# Altium schematic sheet TriMod Adapter 2.SchDoc
size 420 x 297 mm; ApprovedBy: .; CheckedBy: .; Author: DiWou; CompanyName: DL2DW; DrawnBy: DiWou; Engineer: DIWou; Organization: DL2DW; DocumentNumber: 1; Revision: -; SheetNumber: 1; SheetTotal: 1; DrawnDate: 18.12.2020; EngrDate: .; ChkdDate: .; Title1: TriMod Adapter 2.0; Title2: .; Title3: .; Desc1: Version 1.1; Desc2: .; ApprDate: .
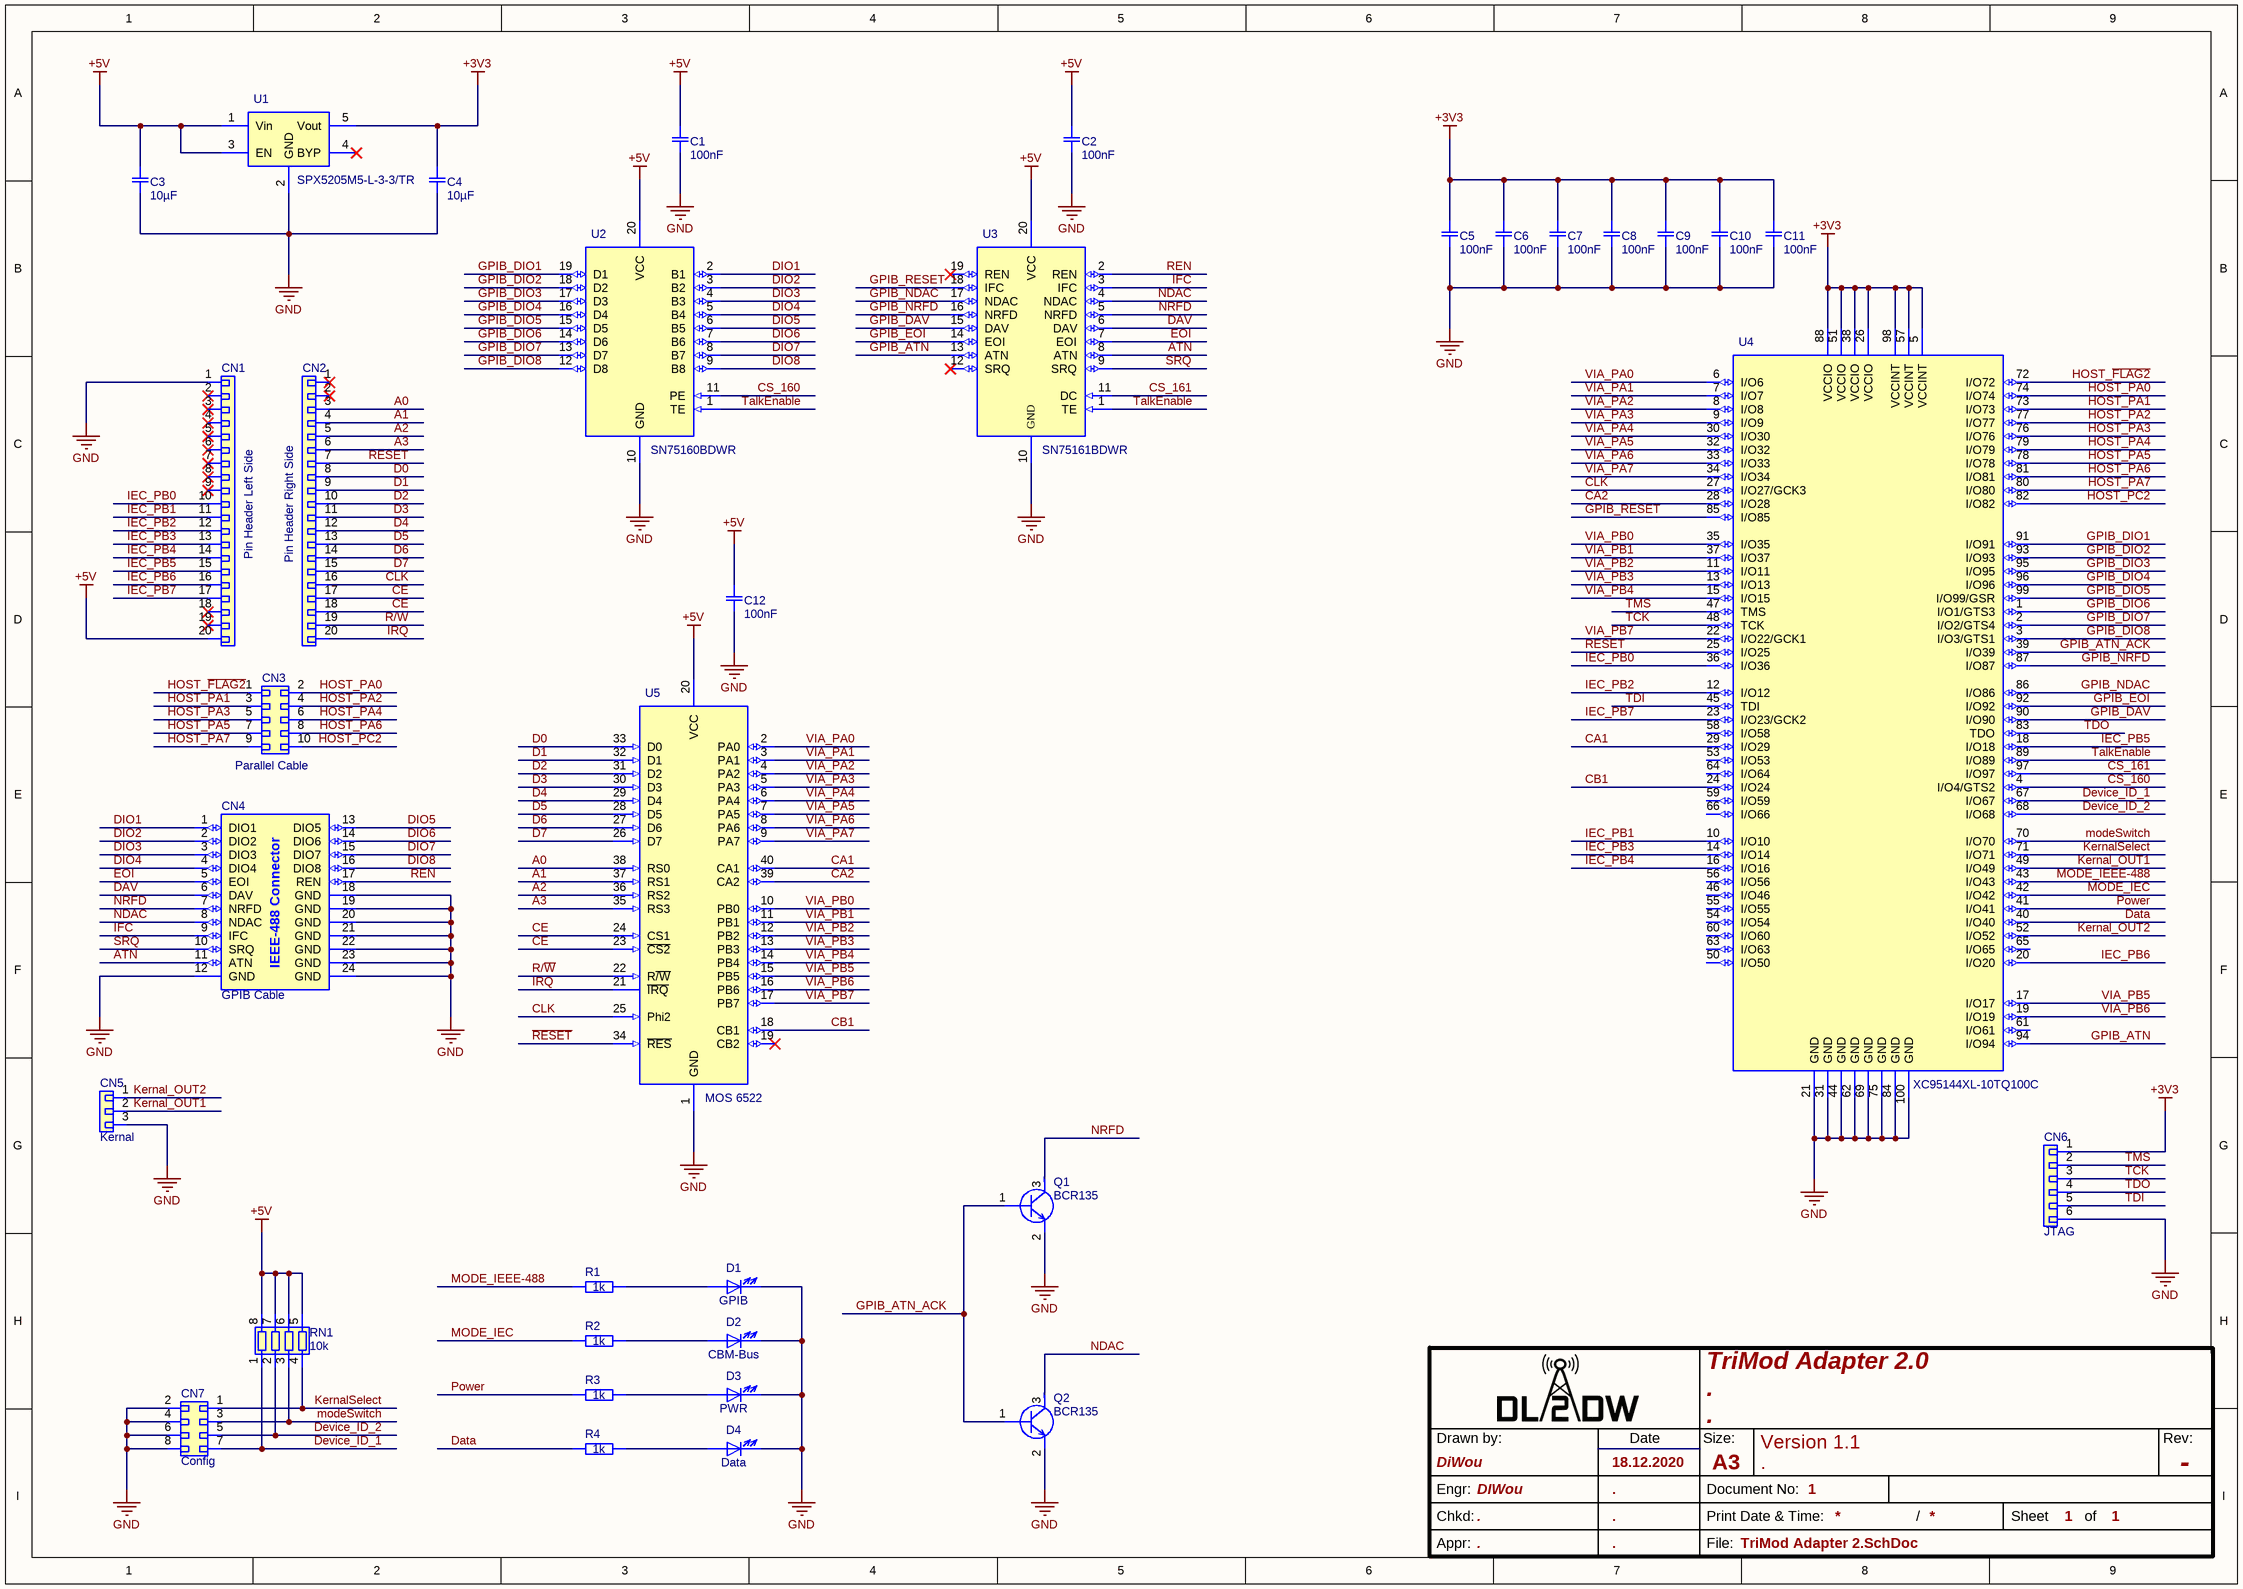
[diagram p0: TriMod Adapter 2.SchDoc]

## Parts
C1  100nF  [CAP 100nF SMD 0603 C0603C104J3RACTU]
C2  100nF  [CAP 100nF SMD 0603 C0603C104J3RACTU]
C3  10µF  [Kemet C0805CxxxK8RACTU Series H=1.4mm]
C4  10µF  [Kemet C0805CxxxK8RACTU Series H=1.4mm]
C5  100nF  [CAP 100nF SMD 0603 C0603C104J3RACTU]
C6  100nF  [CAP 100nF SMD 0603 C0603C104J3RACTU]
C7  100nF  [CAP 100nF SMD 0603 C0603C104J3RACTU]
C8  100nF  [CAP 100nF SMD 0603 C0603C104J3RACTU]
C9  100nF  [CAP 100nF SMD 0603 C0603C104J3RACTU]
C10  100nF  [CAP 100nF SMD 0603 C0603C104J3RACTU]
C11  100nF  [CAP 100nF SMD 0603 C0603C104J3RACTU]
C12  100nF  [CAP 100nF SMD 0603 C0603C104J3RACTU]
CN1  Pin Header Left Side  [Pin Header 01x20 2.54mm precision Horizontal Male]
CN2  Pin Header Right Side  [Pin Header 01x20 2.54mm precision Horizontal Male]
CN3  Parallel Cable  [MPE 369-1-010 Buchsenleisten MicroMatch 1,27 mm,2X05,gerade]
CN4  GPIB Cable  [IEEE-488 Micro Match Connector]
CN5  Kernal  [Pin Header 01x03 2.54mm Horizontal Male]
CN6  JTAG  [Pin Header 01x06 2.54mm Horizontal Male]
CN7  Config  [Pin Header 02x04 2.54mm Horizontal Male]
D1  GPIB  [LED Blue SMD 0603]
D2  CBM-Bus  [LED Green SMD 0603]
D3  PWR  [LED Red SMD 0603]
D4  Data  [LED Yellow SMD 0603]
Q1  BCR135  [BCR135 SOT23]
Q2  BCR135  [BCR135 SOT23]
R1  1k  [1k Ohm R 0603 SMD]
R2  1k  [1k Ohm R 0603 SMD]
R3  1k  [1k Ohm R 0603 SMD]
R4  1k  [1k Ohm R 0603 SMD]
RN1  10k  [RES ARRAY 4 RES 10K OHM 0804]
U1  SPX5205M5-L-3-3/TR  [SOT-23-5]
U2  SN75160BDWR  [SN75160BDWR SOIC-20 W7.5mm P1,27mm]
U3  SN75161BDWR  [SN75161BDWR SOIC-20 W7.5mm P1,27mm]
U4  XC95144XL-10TQ100C  [TQFP-100 P0.5mm XC95144XL-7TQ100C]
U5  MOS 6522  [MOS 6522 with Socket]

## Nets
+3V3: C4.2 C5.2 C6.2 C7.2 C8.2 C9.2 C10.2 C11.2 CN6.1 U1.5(Vout) U4.5(VCCINT) U4.26(VCCIO) U4.38(VCCIO) U4.51(VCCIO) U4.57(VCCINT) U4.88(VCCIO) U4.98(VCCINT)
+5V: C1.2 C2.2 C3.2 C12.2 CN1.20 RN1.5 RN1.6 RN1.7 RN1.8 U1.1(Vin) U1.3(EN) U2.20(VCC) U3.20(VCC) U5.20(VCC)
GND: C1.1 C2.1 C3.1 C4.1 C5.1 C6.1 C7.1 C8.1 C9.1 C10.1 C11.1 C12.1 CN1.1 CN4.12(GND) CN4.18(GND) CN4.19(GND) CN4.20(GND) CN4.21(GND) CN4.22(GND) CN4.23(GND) CN4.24(GND) CN5.3 CN6.6 CN7.2 CN7.4 CN7.6 CN7.8 D1.1 D2.1 D3.1 D4.1 Q1.2 Q2.2 U1.2(GND) U2.10(GND) U3.10(GND) U4.21(GND) U4.31(GND) U4.44(GND) U4.62(GND) U4.69(GND) U4.75(GND) U4.84(GND) U4.100(GND) U5.1(GND)
A0: CN2.3 U5.38(RS0)
A1: CN2.4 U5.37(RS1)
A2: CN2.5 U5.36(RS2)
A3: CN2.6 U5.35(RS3)
ATN: CN4.11(ATN) U3.8(ATN)
~{CE}: CN2.18 U5.23(~{CS2})
CA1: U4.29(I/O29) U5.40(CA1)
CA2: U4.28(I/O28) U5.39(CA2)
CB1: U4.24(I/O24) U5.18(CB1)
CE: CN2.17 U5.24(CS1)
CLK: CN2.16 U4.27(I/O27/GCK3) U5.25(Phi2)
CS_160: U2.11(PE) U4.4(I/O4/GTS2)
CS_161: U3.11(DC) U4.97(I/O97)
D0: CN2.8 U5.33(D0)
D1: CN2.9 U5.32(D1)
D2: CN2.10 U5.31(D2)
D3: CN2.11 U5.30(D3)
D4: CN2.12 U5.29(D4)
D5: CN2.13 U5.28(D5)
D6: CN2.14 U5.27(D6)
D7: CN2.15 U5.26(D7)
Data: R4.1 U4.40(I/O40)
DAV: CN4.6(DAV) U3.6(DAV)
Device_ID_1: CN7.7 RN1.1 U4.67(I/O67)
Device_ID_2: CN7.5 RN1.2 U4.68(I/O68)
DIO1: CN4.1(DIO1) U2.2(B1)
DIO2: CN4.2(DIO2) U2.3(B2)
DIO3: CN4.3(DIO3) U2.4(B3)
DIO4: CN4.4(DIO4) U2.5(B4)
DIO5: CN4.13(DIO5) U2.6(B5)
DIO6: CN4.14(DIO6) U2.7(B6)
DIO7: CN4.15(DIO7) U2.8(B7)
DIO8: CN4.16(DIO8) U2.9(B8)
EOI: CN4.5(EOI) U3.7(EOI)
GPIB_ATN: U3.13(ATN) U4.94(I/O94)
GPIB_ATN_ACK: Q1.1 Q2.1 U4.39(I/O39)
GPIB_DAV: U3.15(DAV) U4.90(I/O90)
GPIB_DIO1: U2.19(D1) U4.91(I/O91)
GPIB_DIO2: U2.18(D2) U4.93(I/O93)
GPIB_DIO3: U2.17(D3) U4.95(I/O95)
GPIB_DIO4: U2.16(D4) U4.96(I/O96)
GPIB_DIO5: U2.15(D5) U4.99(I/O99/GSR)
GPIB_DIO6: U2.14(D6) U4.1(I/O1/GTS3)
GPIB_DIO7: U2.13(D7) U4.2(I/O2/GTS4)
GPIB_DIO8: U2.12(D8) U4.3(I/O3/GTS1)
GPIB_EOI: U3.14(EOI) U4.92(I/O92)
GPIB_NDAC: U3.17(NDAC) U4.86(I/O86)
GPIB_NRFD: U3.16(NRFD) U4.87(I/O87)
GPIB_RESET: U3.18(IFC) U4.85(I/O85)
HOST_~{FLAG2}: CN3.1 U4.72(I/O72)
HOST_~{PC2}: CN3.10 U4.82(I/O82)
HOST_PA0: CN3.2 U4.74(I/O74)
HOST_PA1: CN3.3 U4.73(I/O73)
HOST_PA2: CN3.4 U4.77(I/O77)
HOST_PA3: CN3.5 U4.76(I/O76)
HOST_PA4: CN3.6 U4.79(I/O79)
HOST_PA5: CN3.7 U4.78(I/O78)
HOST_PA6: CN3.8 U4.81(I/O81)
HOST_PA7: CN3.9 U4.80(I/O80)
~{IRQ}: CN2.20 U5.21(~{IRQ})
IEC_PB0: CN1.10 U4.36(I/O36)
IEC_PB1: CN1.11 U4.10(I/O10)
IEC_PB2: CN1.12 U4.12(I/O12)
IEC_PB3: CN1.13 U4.14(I/O14)
IEC_PB4: CN1.14 U4.16(I/O16)
IEC_PB5: CN1.15 U4.18(I/O18)
IEC_PB6: CN1.16 U4.20(I/O20)
IEC_PB7: CN1.17 U4.23(I/O23/GCK2)
IFC: CN4.9(IFC) U3.3(IFC)
Kernal_OUT1: CN5.2 U4.49(I/O49)
Kernal_OUT2: CN5.1 U4.52(I/O52)
KernalSelect: CN7.1 RN1.4 U4.71(I/O71)
MODE_IEC: R2.1 U4.42(I/O42)
MODE_IEEE-488: R1.1 U4.43(I/O43)
modeSwitch: CN7.3 RN1.3 U4.70(I/O70)
NDAC: CN4.8(NDAC) Q2.3 U3.4(NDAC)
NRFD: CN4.7(NRFD) Q1.3 U3.5(NRFD)
Power: R3.1 U4.41(I/O41)
R/~{W}: CN2.19 U5.22(R~{/W})
~{RESET}: CN2.7 U4.25(I/O25) U5.34(~{RES})
REN: CN4.17(REN) U3.2(REN)
SRQ: CN4.10(SRQ) U3.9(SRQ)
TalkEnable: U2.1(TE) U3.1(TE) U4.89(I/O89)
TCK: CN6.3 U4.48(TCK)
TDI: CN6.5 U4.45(TDI)
TDO: CN6.4 U4.83(TDO)
TMS: CN6.2 U4.47(TMS)
VIA_PA0: U4.6(I/O6) U5.2(PA0)
VIA_PA1: U4.7(I/O7) U5.3(PA1)
VIA_PA2: U4.8(I/O8) U5.4(PA2)
VIA_PA3: U4.9(I/O9) U5.5(PA3)
VIA_PA4: U4.30(I/O30) U5.6(PA4)
VIA_PA5: U4.32(I/O32) U5.7(PA5)
VIA_PA6: U4.33(I/O33) U5.8(PA6)
VIA_PA7: U4.34(I/O34) U5.9(PA7)
VIA_PB0: U4.35(I/O35) U5.10(PB0)
VIA_PB1: U4.37(I/O37) U5.11(PB1)
VIA_PB2: U4.11(I/O11) U5.12(PB2)
VIA_PB3: U4.13(I/O13) U5.13(PB3)
VIA_PB4: U4.15(I/O15) U5.14(PB4)
VIA_PB5: U4.17(I/O17) U5.15(PB5)
VIA_PB6: U4.19(I/O19) U5.16(PB6)
VIA_PB7: U4.22(I/O22/GCK1) U5.17(PB7)
NetD1_2: D1.2 R1.2
NetD2_2: D2.2 R2.2
NetD3_2: D3.2 R3.2
NetD4_2: D4.2 R4.2

Not connected (* = marked no-connect by the designer): CN1 2* 3* 4* 5* 6* 7* 8* 9* 18* 19*; CN2 1* 2*; U1 4(BYP)*; U3 12(SRQ)* 19(REN)*; U4 46(I/O46) 50(I/O50) 53(I/O53) 54(I/O54) 55(I/O55) 56(I/O56) 58(I/O58) 59(I/O59) 60(I/O60) 61(I/O61) 63(I/O63) 64(I/O64) 65(I/O65) 66(I/O66); U5 19(CB2)*

## Notes on the sheet
- Drawn by:
- Date
- Size:
- A3
- Rev:
- Engr:
- Chkd:
- Appr:
- File:
- Document No:
- Print Date & Time:
- /
- Sheet
- of

## Library data of the parts
C1 C2 C5-C12 = CMP-Capacitors-Ceramic_Capacitors-00012-1: KEMET         C0603C104J3RACTU             SMD Multilayer Ceramic Capacitor, 0603 [1608 Metric], 0.1 F, 25 V,  5%, X7R, C Series; Voltage Rating (DC): 25V; Height: 0.8mm; Dielectric: X7R; Case Code (Metric): 1608; Width: 0.031inch; Depth: 0.8mm; Min Operating Temperature: -55°C; Number of Pins: 2; Mount: Surface Mount,PCB; REACH SVHC: No SVHC; Packaging: Tape and Reel; Case Code (Imperial): 0603; Contact Plating: Tin,Matte; Length: 1.6mm; Case/Package: 0603; Lead Pitch: 0.7mm; Package Quantity: 4000; Tolerance: 5%; Radiation Hardening: No; Dielectric Material: Ceramic; Voltage: 25V; Termination: SMD/SMT; Capacitance: 100nF; Voltage Rating: 25V; Thickness: 0.034inch; Max Operating Temperature: 125°C
C3 C4 = CMP-Capacitors-Ceramic_Capacitors-00016-2: KEMET - C0805C106K8RACTU - CAP, 10µF, 10V, 10%, X7R, 0805; Dissipation Factor: 7.5%; Capacitance: 10uF; Max Operating Temperature: 125°C; Packaging: Tape and Reel; Case Code (Imperial): 0805; Depth: 1.25mm; Dielectric Material: Ceramic; Voltage: 10V; Voltage Rating (DC): 10V; Mount: Surface Mount,PCB; Min Operating Temperature: -55°C; Case Code (Metric): 2012; Case/Package: 0805; Thickness: 0.055inch; Termination: SMD/SMT; Voltage Rating: 10V; Height: 1.25mm; Dielectric: X7R; Width: 1.2mm; Package Quantity: 1; Length: 2mm; REACH SVHC: No SVHC; Tolerance: 10%
CN1 CN2 = CMP-Connectors-Male_PIN_Headers-00031-2: Conn Header Vert 20POS 2MM; Connector Type: Male Pin; Number of Positions: 20; Pitch: 0.079inch; Contact Mating Length: 0.141inch; Package Quantity: 250; Mount: Through Hole; Color: Black; Packaging: Bulk; Contact Plating: Gold; Number of Rows: 1; Termination: Solder
CN3 = CMP-Connectors-IDC_Connectors-00031-3: Grid pitch: 1.27 mm BL2/15-0400GTT-010 RU MPE Garry Conten; Pitch: 1.27mm; Height: 3.95mm; Contact Material: Bronze,Tin; Length: 14.62mm; Insulation Material: Thermoplastic; Width: 5mm
CN4 = CMP-Commodore-00011-5: IEEE-488 IDC Connector Right Angle or Straight
CN5 = CMP-Connectors-Male_PIN_Headers-00002-3: CONN HEADER .100" SNGL STR 3POS; Pitch: 0.1inch; Number of Positions: 3; Connector Type: Male Pin; Mount: Through Hole; Color: Black; Contact Mating Length: 0.318inch; Package Quantity: 1; Termination: Solder; Number of Rows: 1; Contact Plating: Gold; Packaging: Bulk
CN6 = CMP-Connectors-Male_PIN_Headers-00005-2: CONN HEADER VERT 6POS 2.54MM; Connector Type: Male Pin; Pitch: 0.1inch; Number of Positions: 6; Packaging: Bulk; Termination: Solder; Package Quantity: 1; Contact Mating Length: 0.318inch; Contact Plating: Gold; Color: Black; Mount: Through Hole; Number of Rows: 1
CN7 = CMP-Connectors-Male_PIN_Headers-00033-2: CONN HEADER .100" DUAL STR 8POS; Connector Type: Male Pin; Number of Positions: 8; Pitch: 0.1inch; Packaging: Bulk; Contact Plating: Gold; Termination: Solder; Number of Rows: 2; Series: -; Color: Black; Contact Mating Length: 0.318inch; RoHS Compliant: Yes; Contact Type: Male Pin; Package Quantity: 1; Row Spacing: 0.1inch; Mount: Through Hole
D1 = CMP-LEDs-00001-1: LED BLUE DIFFUSED 0603 SMD; Lens Style: Flat; Lens Size: 0.8mm; Viewing Angle: 140°; Test Current: 20mA; Dominant Wavelength: 470nm; Forward Voltage: 3.2V; Luminous Intensity: 80mcd; Case/Package: 0603; Length: 1.6mm; Lens Transparency: Diffused; Height: 0.5mm; Color: Blue; Mount: Surface Mount; Width: 0.8mm; Packaging: Tape and Reel
D2 = CMP-LEDs-00004-2: LED BLUE DIFFUSED 0603 SMD; Dominant Wavelength: 470nm; Test Current: 20mA; Lens Style: Flat; Viewing Angle: 140°; Forward Voltage: 3.2V; Lens Size: 0.8mm; Luminous Intensity: 80mcd; Color: Blue; Case/Package: 0603; Mount: Surface Mount; Width: 0.8mm; Lens Transparency: Diffused; Length: 1.6mm; Height: 0.5mm; Packaging: Tape and Reel
D3 = CMP-LEDs-00005-1: LED RED DIFFUSED 0603 SMD; Viewing Angle: 140°; Dominant Wavelength: 630nm; Luminous Intensity: 70mcd; Forward Voltage: 2V; Test Current: 20mA; Lens Style: Flat; Lens Size: 0.8mm; Lens Transparency: Diffused; Packaging: Tape and Reel; Case/Package: 0603; Case Code (Imperial): 0603; Width: 0.8mm; Length: 1.6mm; Height: 0.5mm; Case Code (Metric): 1608; Color: Red; Mount: Surface Mount
D4 = CMP-LEDs-00003-2: LED YELLOW DIFFUSED 0603 SMD; Test Current: 20mA; Forward Voltage: 2V; Luminous Intensity: 100mcd; Lens Style: Flat; Dominant Wavelength: 589nm; Viewing Angle: 140°; Lens Size: 0.8mm; Length: 1.6mm; Mount: Surface Mount; Packaging: Cut Tape; Lens Transparency: Diffused; Case/Package: 0603; Color: Yellow; Case Code (Metric): 1608; Case Code (Imperial): 0603; Height: 0.5mm; Width: 0.8mm
Q1 Q2 = CMP-Transistors-00010-1: BCR135 Series NPN 50 V 100 mA SMT Silicon Digital Transistor - SOT-23-3; Max Collector Current: 100mA; Collector Emitter Saturation Voltage: 300mV; Element Configuration: Single; hFE Min: 70; Power Dissipation: 200mW; Collector Emitter Voltage (VCEO): 50V; Polarity: NPN; Length: 2.9mm; Min Operating Temperature: -65°C; Number of Pins: 3; Width: 1.3mm; Max Operating Temperature: 150°C; Case/Package: SOT; Packaging: Tape and Reel; Height: 1mm
R1-R4 = CMP-Resistors-Yageo_SMD_060300002-2: RES SMD 1K OHM 1% 1/10W 0603; Temperature Coefficient: 100ppm/°C; Voltage Rating: 50V; Power Rating: 100mW; Resistance: 1kR; Case Code (Imperial): 0603; Length: 1.6mm; Termination: SMD/SMT; Radiation Hardening: No; Depth: 0.8mm; Tolerance: 1%; Height: 0.45mm; Packaging: Tape and Reel; Min Operating Temperature: -55°C; Lead Free: Lead Free; Max Operating Temperature: 155°C; REACH SVHC: No SVHC; Case Code (Metric): 1608; Resistor Type: Thick Film; Contact Plating: Tin,Matte; Case/Package: 0603; Military Standard: Not
RN1 = CMP-Resistors-Resistor_Array00009-1: RES ARRAY 4 RES 10K OHM 0804; Resistance: 10kR; Tolerance: 1%; Number of Circuits: 4; Power Per Element: 62.5mW; Temperature Coefficient: 200ppm/°C; Circuit Type: Isolated; Max Operating Temperature: 125°C; Length: 0.079inch; Min Operating Temperature: -55°C; Case/Package: 0804; Packaging: Tape and Reel; Height: 0.02inch; Number of Pins: 8; Mount: Surface Mount; Number of Resistors: 4; Width: 0.039inch
U1 = CMP-ICs-Power_Supply-00002-2: LDO Regulator Pos 3.3V 0.15A 5-Pin SOT-23 T/R; Min Input Voltage: 2.5V; Number of Outputs: 1; Dropout Voltage: 210mV; Accuracy: 1%; Polarity: Positive; Max Input Voltage: 16V; Output Type: Fixed; Output Current: 150mA; Quiescent Current: 1uA; Packaging: Tape and Reel; Lead Free: Lead Free; Case/Package: SOT-23; Height: 1.15mm; Number of Regulators: 1; Max Operating Temperature: 125°C; Min Operating Temperature: -40°C; Output Voltage: 3.3V; Width: 1.6mm; Radiation Hardening: No; Mount: Surface Mount; Length: 2.9mm; Max Output Current: 150mA; Min Output Voltage: 3.3V; Number of Pins: 5
U2 = CMP-ICs-Specials-00023-1: TEXAS INSTRUMENTS         SN75160BDWR.            GENERAL-PURPOSE INTERFACE BUS  ((NW)); Propagation Delay: 22ns; Number of Drivers: 8; Max Supply Current: 110mA; Operating Supply Voltage: 5V; High Level Output Current: -5.2mA; ESD Protection: No; Max Supply Voltage: 5.25V; Output Current: 48mA; Min Supply Voltage: 4.75V; Number of Transceivers: 1; Logic Function: Transceiver; Min Operating Temperature: 0°C; Radiation Hardening: No; Lead Free: Lead Free; Package Quantity: 1; Case/Package: SOIC; Number of Transmitters: 8; Contact Plating: Gold; Weight: 0.018953oz; Number of Channels: 8; Max Operating Temperature: 70°C; REACH SVHC: No SVHC; Number of Receivers: 8; Packaging: Tape and Reel; Low Level Output Current: 48mA; Number of Pins: 20; Nominal Supply Current: 110mA; Mount: Surface Mount
U3 = CMP-ICs-Specials-00022-2: TEXAS INSTRUMENTS         SN75161BDWR; Number of Transceivers: 1; Number of Transmitters: 8; Propagation Delay: 22ns; Logic Function: Transceiver; Operating Supply Voltage: 5V; Low Level Output Current: 48mA; Min Supply Voltage: 4.75V; Max Supply Voltage: 5.25V; High Level Output Current: -5.2mA; Nominal Supply Current: 110mA; Package Quantity: 1; Packaging: Tape and Reel; REACH SVHC: No SVHC; Number of Drivers: 8; Number of Channels: 8; Lead Free: Lead Free; Max Operating Temperature: 70°C; Mount: Surface Mount; Number of Pins: 20; Case/Package: SOIC; Weight: 0.018953oz; Output Current: 48mA; Number of Receivers: 8; Operating Supply Current: 110mA; Min Operating Temperature: 0°C; Radiation Hardening: No
U4 = CMP-ICs-CPLD_FPGA-00000-1: IC CPLD 144MC 7.5NS 100TQFP; Speed Grade: 7; Operating Supply Voltage: 3.3V; Max Supply Voltage: 3.6V; Number of Gates: 3200; Min Supply Voltage: 3V; Number of I/Os: 81; Number of Macrocells: 144; Number of Logic Blocks (LABs): 8; Max Frequency: 125MHz; Memory Type: FLASH; Turn-On Delay Time: 7.5ns; Mount: Surface Mount; Number of Pins: 100; Propagation Delay: 7.5ns; Package Quantity: 90; Case/Package: LQFP; Contact Plating: Tin,Lead; Packaging: Tray; Lead Free: Contains Lead; Min Operating Temperature: 0°C; Number of Logic Elements/Cells: 8; Max Operating Temperature: 70°C
U5 = CMP-ICs-Specials-00001-3: I/O Controller Interface IC Versatile Interface Adapter; Operating Supply Voltage: 5V; Interface: Serial; Operating Supply Current: 500uA; Data Bus Width: 8b; Min Operating Temperature: -40°C; Packaging: Rail/Tube; Case/Package: PDIP; Max Operating Temperature: 85°C; Weight: 0.210004oz